# EAGLE board K019 (EAGLE 6.3), part 1 of 4
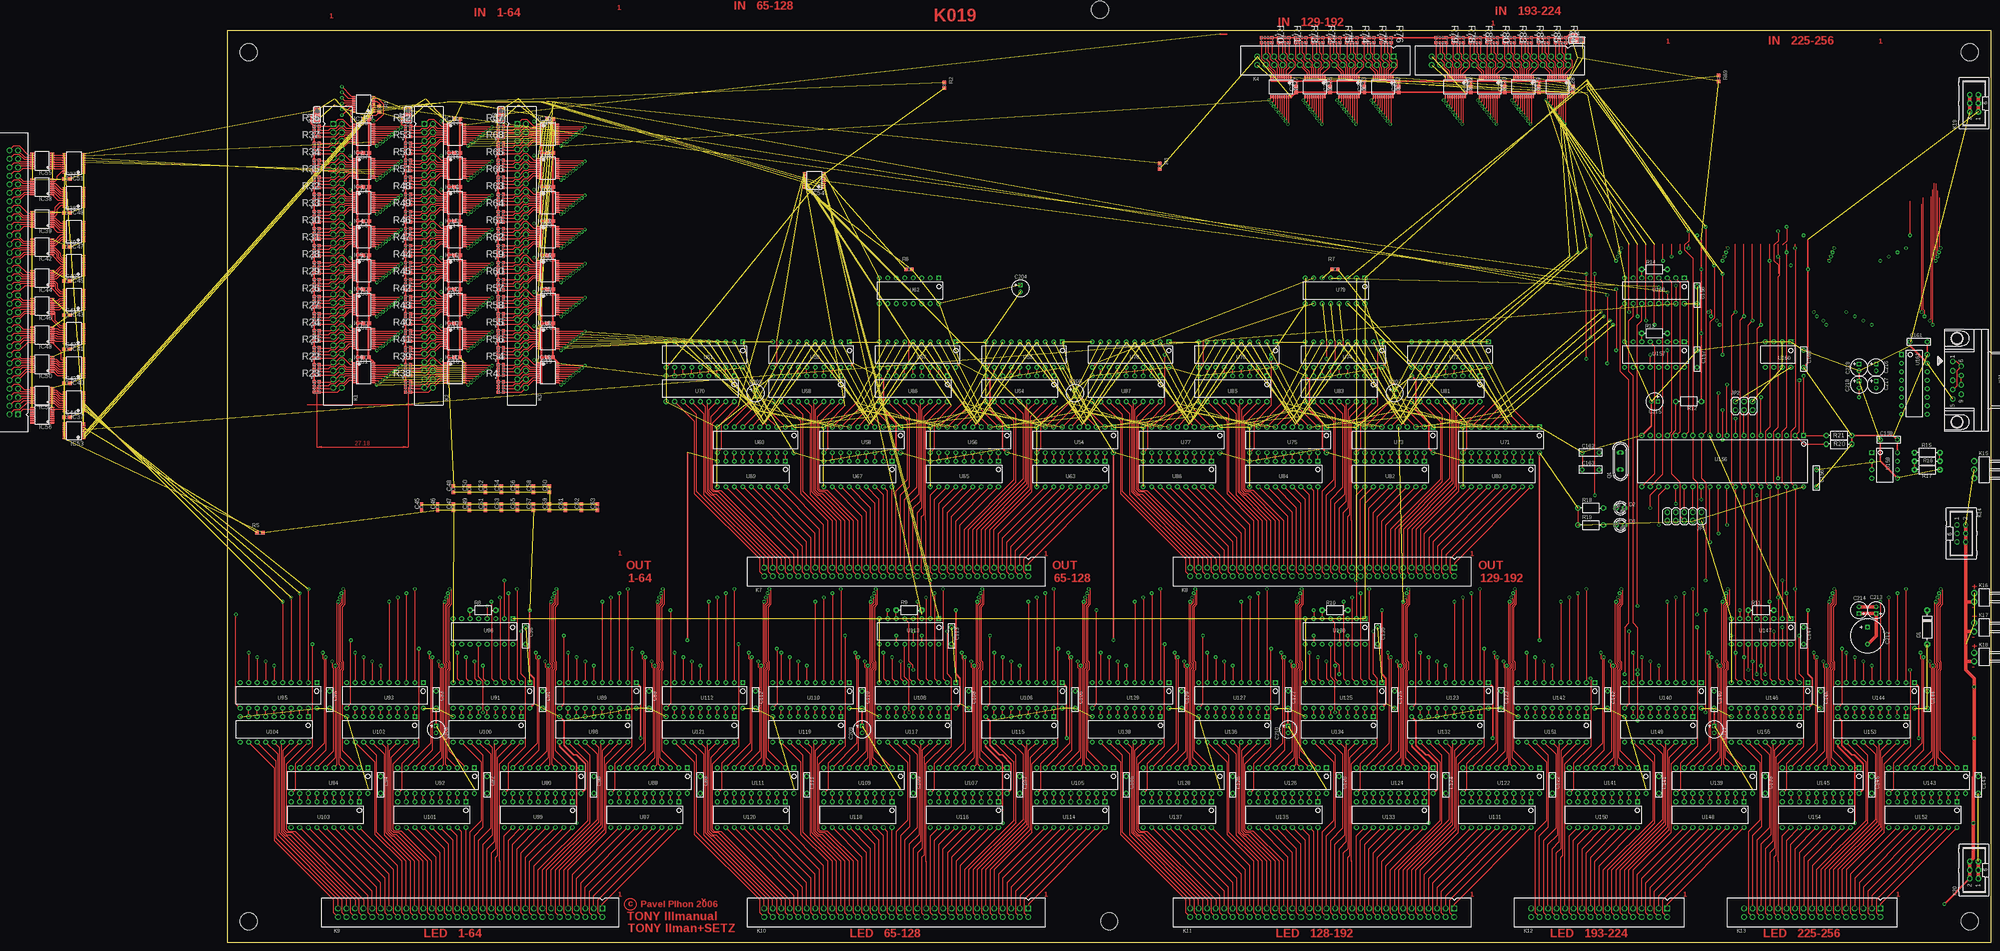
[diagram p5: board, top side]
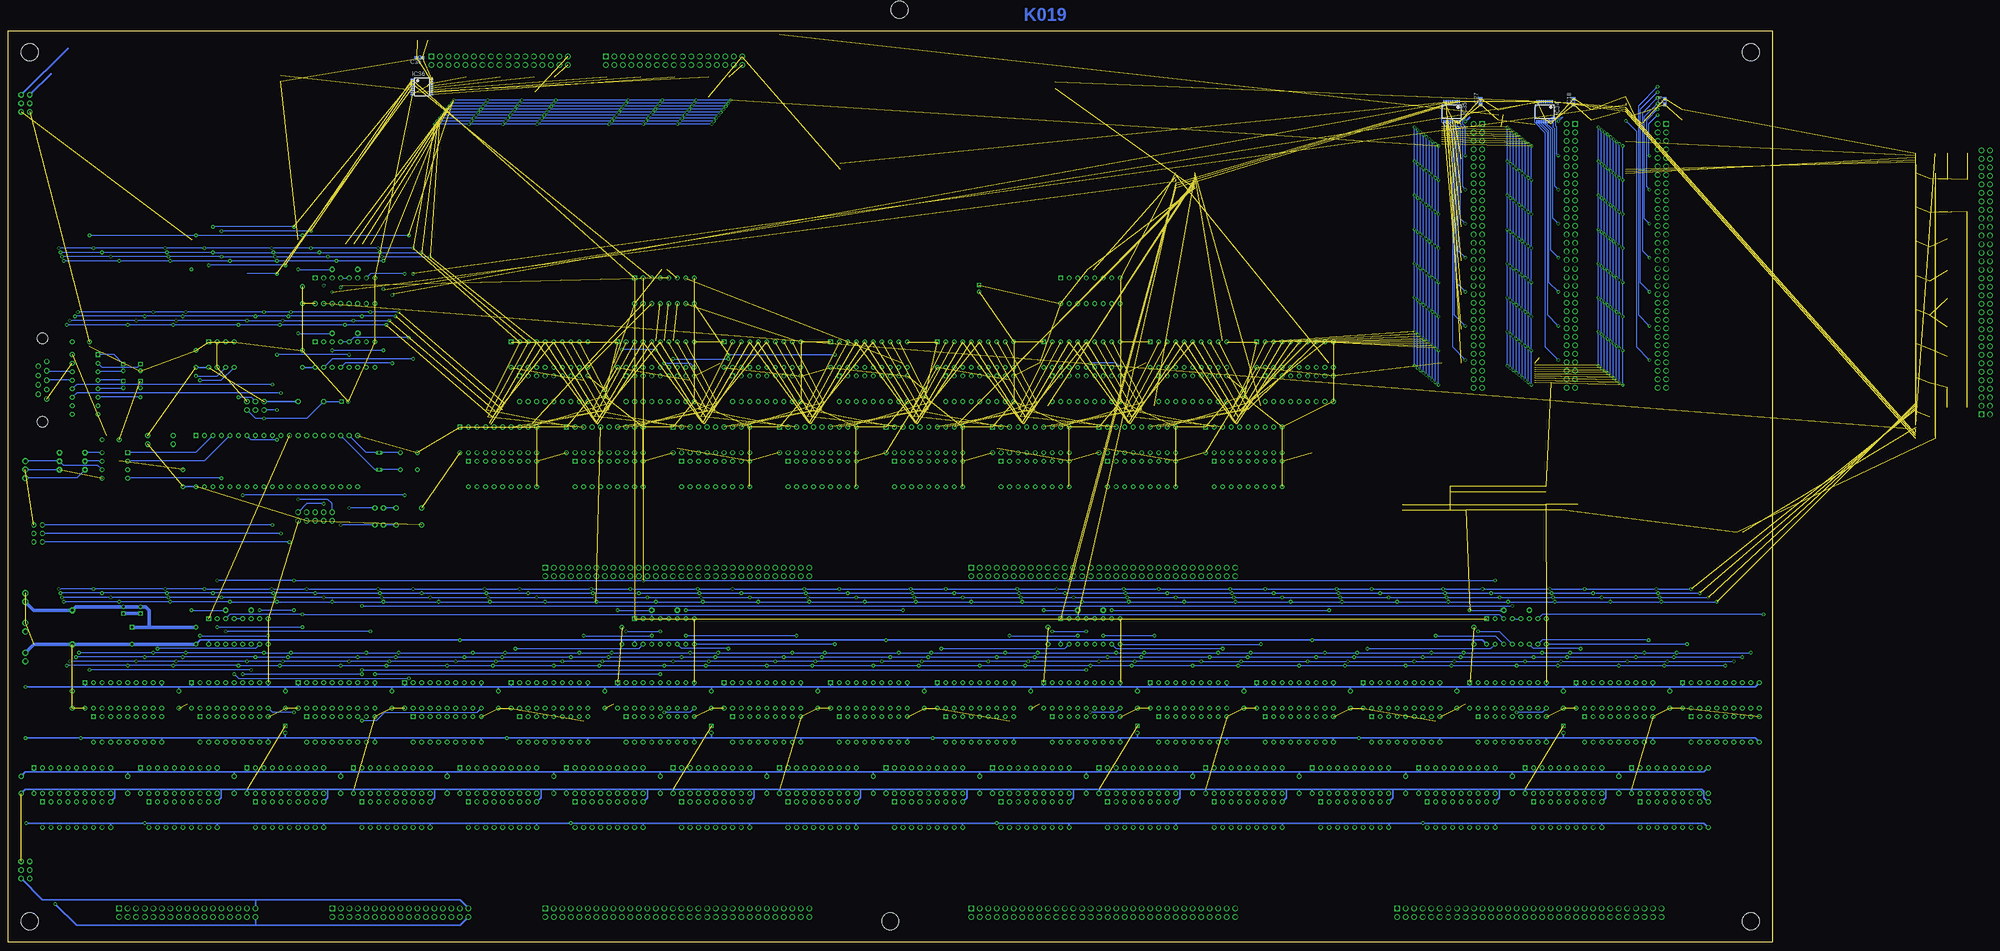
[diagram p6: board, bottom side, seen from below]

Size 525.78 x 271.78 mm. Coordinates in mm from the lower left corner, seen from the top.
Outline: 0,0 525.78,0 525.78,271.78 0,271.78 0,0
Copper layers (1*16): Top 0.035mm / dielectric 1.5mm / Bottom 0.035mm
Design rules "default *": minimum track width 10mil, minimum drill 24mil, track to track 0.2mm, track to pad 0.2mm, pad to pad 0.2mm, via to via 0.2mm, smd to smd 0mil, copper to edge 40mil, drill to drill 8mil, minimum pad ring 10mil, minimum via ring 8mil, stop-mask expansion 4mil, vias tented up to drill 0mil, thermal gap 10mil
Holes 5.08 mm at 6.35,265.43 6.35,6.35 519.43,6.35 519.43,265.43 260.1,278.13 262.89,6.35

## Footprints (pad centres in the part's own frame; a part is rotated, then mirrored left to right if it is on the bottom)
C0603 = smd 1.1 x 1: 1 -0.85,0; 2 0.85,0
C-5-2X8 = drill 0.813 pad 1.397: 1 0,0; 2 5.08,0
EC-2/5 = drill 0.711 pad 1.092: 1 1.016,0 | drill 0.711 pad 1.092 square: 2 -1.016,0
EC-5 = drill 0.813 pad 1.397 square: 1 -2.54,0 | drill 0.813 pad 1.397: 2 2.54,0
D-10 = drill 0.813 pad 1.778 octagon: 1 -5.08,0; 2 5.08,0
LED3 = drill 0.813 pad 1.6 octagon: A -1.27,0 | drill 0.813 pad 1.6: K 1.27,0
TSSOP20 = smd 0.35 x 0.9: 1 0,0; 2 0.65,0; 3 1.3,0; 4 1.95,0; 5 2.6,0; 6 3.25,0; 7 3.9,0; 8 4.55,0; 9 5.2,0; 10 5.85,0; 11 5.85,5.85; 12 5.2,5.85; 13 4.55,5.85; 14 3.9,5.85; 15 3.25,5.85; 16 2.6,5.85; 17 1.95,5.85; 18 1.3,5.85; 19 0.65,5.85; 20 0,5.85
TSSOP16 = smd 0.35 x 0.9: 1 0,0; 2 0.65,0; 3 1.3,0; 4 1.95,0; 5 2.6,0; 6 3.25,0; 7 3.9,0; 8 4.55,0; 9 4.55,5.85; 10 3.9,5.85; 11 3.25,5.85; 12 2.6,5.85; 13 1.95,5.85; 14 1.3,5.85; 15 0.65,5.85; 16 0,5.85
SSOP16 = smd 0.35 x 1.2: 1 0,0; 2 0.65,0; 3 1.3,0; 4 1.95,0; 5 2.6,0; 6 3.25,0; 7 3.9,0; 8 4.55,0; 9 4.55,5.85; 10 3.9,5.85; 11 3.25,5.85; 12 2.6,5.85; 13 1.95,5.85; 14 1.3,5.85; 15 0.65,5.85; 16 0,5.85
2X05 = drill 1.016 octagon: 1 -5.08,-1.27; 2 -5.08,1.27; 3 -2.54,-1.27; 4 -2.54,1.27; 5 0,-1.27; 6 0,1.27; 7 2.54,-1.27; 8 2.54,1.27; 9 5.08,-1.27; 10 5.08,1.27
2X03 = drill 1.016 octagon: 1 -2.54,-1.27; 2 -2.54,1.27; 3 0,-1.27; 4 0,1.27; 5 2.54,-1.27; 6 2.54,1.27
KON64 = drill 1.092 pad 1.6 square: 1 0,0 | drill 1.092 pad 1.6: 2 0,2.54; 3 2.54,0; 4 2.54,2.54; 5 5.08,0; 6 5.08,2.54; 7 7.62,0; 8 7.62,2.54; 9 10.16,0; 10 10.16,2.54; 11 12.7,0; 12 12.7,2.54; 13 15.24,0; 14 15.24,2.54; 15 17.78,0; 16 17.78,2.54; 17 20.32,0; 18 20.32,2.54; 19 22.86,0; 20 22.86,2.54; 21 25.4,0; 22 25.4,2.54; 23 27.94,0; 24 27.94,2.54; 25 30.48,0; 26 30.48,2.54; 27 33.02,0; 28 33.02,2.54; 29 35.56,0; 30 35.56,2.54; 31 38.1,0; 32 38.1,2.54; 33 40.64,0; 34 40.64,2.54; 35 43.18,0; 36 43.18,2.54; 37 45.72,0; 38 45.72,2.54; 39 48.26,0; 40 48.26,2.54; 41 50.8,0; 42 50.8,2.54; 43 53.34,0; 44 53.34,2.54; 45 55.88,0; 46 55.88,2.54; 47 58.42,0; 48 58.42,2.54; 49 60.96,0; 50 60.96,2.54; 51 63.5,0; 52 63.5,2.54; 53 66.04,0; 54 66.04,2.54; 55 68.58,0; 56 68.58,2.54; 57 71.12,0; 58 71.12,2.54; 59 73.66,0; 60 73.66,2.54; 61 76.2,0; 62 76.2,2.54; 63 78.74,0; 64 78.74,2.54
KON34 = drill 1.092 pad 1.6 square: 1 0,0 | drill 1.092 pad 1.6: 2 0,2.54; 3 2.54,0; 4 2.54,2.54; 5 5.08,0; 6 5.08,2.54; 7 7.62,0; 8 7.62,2.54; 9 10.16,0; 10 10.16,2.54; 11 12.7,0; 12 12.7,2.54; 13 15.24,0; 14 15.24,2.54; 15 17.78,0; 16 17.78,2.54; 17 20.32,0; 18 20.32,2.54; 19 22.86,0; 20 22.86,2.54; 21 25.4,0; 22 25.4,2.54; 23 27.94,0; 24 27.94,2.54; 25 30.48,0; 26 30.48,2.54; 27 33.02,0; 28 33.02,2.54; 29 35.56,0; 30 35.56,2.54; 31 38.1,0; 32 38.1,2.54; 33 40.64,0; 34 40.64,2.54
ML6 = drill 0.914 octagon: 1 -2.54,-1.27; 2 -2.54,1.27; 3 0,-1.27; 4 0,1.27; 5 2.54,-1.27; 6 2.54,1.27
PSH02-03 = drill 1.092 pad 1.803: 1 0,0; 2 2.54,0; 3 5.08,0
PSH02-02 = drill 1.092 pad 1.803: 1 0,0; 2 2.54,0
ML06 = drill 0.914 pad 1.6: 1 -2.54,-1.27 | drill 0.914 pad 1.6 octagon: 2 -2.54,1.27; 3 0,-1.27; 4 0,1.27; 5 2.54,-1.27; 6 2.54,1.27
D-09F/90 = drill 1.016 pad 1.575 octagon: 1 -5.588,-1.27; 2 -2.794,-1.27; 3 0,-1.27; 4 2.794,-1.27; 5 5.588,-1.27; 6 -4.191,1.27; 7 -1.397,1.27; 8 1.397,1.27; 9 4.191,1.27 | hole 3.2: 12.446,0; -12.446,0
QS = drill 0.61 long: 1 -2.54,0; 2 2.54,0
R0603 = smd 1 x 1.1: 1 -0.85,0; 2 0.85,0
RESCAXE80P320X160X60-8N = smd 0.864 x 0.965: 1 -0.762,1.524; 4 -0.762,-1.524; 5 0.762,-1.524; 8 0.762,1.524 | smd 0.864 x 0.457: 2 -0.762,0.432; 3 -0.762,-0.432; 6 0.762,-0.432; 7 0.762,0.432
R-7,5 = drill 0.813 pad 1.6 octagon: 1 -3.81,0; 2 3.81,0
SJ_2 = smd 1.168 x 1.6: 1 -1.524,0; 2 0,0; 3 1.524,0
DIL20 = drill 0.813 pad 1.397 square: 1 0,0 | drill 0.813 pad 1.397: 2 2.54,0; 3 5.08,0; 4 7.62,0; 5 10.16,0; 6 12.7,0; 7 15.24,0; 8 17.78,0; 9 20.32,0; 10 22.86,0; 11 22.86,7.62; 12 20.32,7.62; 13 17.78,7.62; 14 15.24,7.62; 15 12.7,7.62; 16 10.16,7.62; 17 7.62,7.62; 18 5.08,7.62; 19 2.54,7.62; 20 0,7.62
DIL16 = drill 0.813 pad 1.397 square: 1 0,0 | drill 0.813 pad 1.397: 2 2.54,0; 3 5.08,0; 4 7.62,0; 5 10.16,0; 6 12.7,0; 7 15.24,0; 8 17.78,0; 9 17.78,7.62; 10 15.24,7.62; 11 12.7,7.62; 12 10.16,7.62; 13 7.62,7.62; 14 5.08,7.62; 15 2.54,7.62; 16 0,7.62
DIL18 = drill 0.813 pad 1.397 square: 1 0,0 | drill 0.813 pad 1.397: 2 2.54,0; 3 5.08,0; 4 7.62,0; 5 10.16,0; 6 12.7,0; 7 15.24,0; 8 17.78,0; 9 20.32,0; 10 20.32,7.62; 11 17.78,7.62; 12 15.24,7.62; 13 12.7,7.62; 14 10.16,7.62; 15 7.62,7.62; 16 5.08,7.62; 17 2.54,7.62; 18 0,7.62
DIL40 = drill 0.813 pad 1.397 square: 1 -24.13,-7.62 | drill 0.813 pad 1.397: 2 -21.59,-7.62; 3 -19.05,-7.62; 4 -16.51,-7.62; 5 -13.97,-7.62; 6 -11.43,-7.62; 7 -8.89,-7.62; 8 -6.35,-7.62; 9 -3.81,-7.62; 10 -1.27,-7.62; 11 1.27,-7.62; 12 3.81,-7.62; 13 6.35,-7.62; 14 8.89,-7.62; 15 11.43,-7.62; 16 13.97,-7.62; 17 16.51,-7.62; 18 19.05,-7.62; 19 21.59,-7.62; 20 24.13,-7.62; 21 24.13,7.62; 22 21.59,7.62; 23 19.05,7.62; 24 16.51,7.62; 25 13.97,7.62; 26 11.43,7.62; 27 8.89,7.62; 28 6.35,7.62; 29 3.81,7.62; 30 1.27,7.62; 31 -1.27,7.62; 32 -3.81,7.62; 33 -6.35,7.62; 34 -8.89,7.62; 35 -11.43,7.62; 36 -13.97,7.62; 37 -16.51,7.62; 38 -19.05,7.62; 39 -21.59,7.62; 40 -24.13,7.62
DIL-08 = drill 0.813 pad 1.397 square: 1 0,0 | drill 0.813 pad 1.397: 2 2.54,0; 3 5.08,0; 4 7.62,0; 5 7.62,7.62; 6 5.08,7.62; 7 2.54,7.62; 8 0,7.62

## Placement (x,y rotation side)
C1  100n  [C0603]  41.34,174.43 180 top
C2  100n  [C0603]  41.4,184.59 180 top
C3  100n  [C0603]  41.4,194.75 180 top
C4  100n  [C0603]  41.4,204.91 180 top
C5  100n  [C0603]  41.4,215.07 180 top
C6  100n  [C0603]  41.4,225.23 180 top
C7  100n  [C0603]  41.4,235.39 180 top
C8  100n  [C0603]  41.4,245.55 180 top
C9  100n  [C0603]  32,250.7 90 bottom
C10  100n  [C0603]  68.52,174.43 180 top
C11  100n  [C0603]  68.58,184.59 180 top
C12  100n  [C0603]  68.58,194.75 180 top
C13  100n  [C0603]  68.58,204.91 180 top
C14  100n  [C0603]  68.58,215.07 180 top
C15  100n  [C0603]  68.58,225.23 180 top
C16  100n  [C0603]  68.58,235.39 180 top
C17  100n  [C0603]  68.58,245.55 180 top
C18  100n  [C0603]  59.18,250.7 90 bottom
C19  100n  [C0603]  96.2,174.43 180 top
C20  100n  [C0603]  96.27,184.59 180 top
C21  100n  [C0603]  96.27,194.75 180 top
C22  100n  [C0603]  96.27,204.91 180 top
C23  100n  [C0603]  96.27,215.07 180 top
C24  100n  [C0603]  96.27,225.23 180 top
C25  100n  [C0603]  96.27,235.39 180 top
C26  100n  [C0603]  96.27,245.55 180 top
C27  100n  [C0603]  86.87,250.7 90 bottom
C28  100n  [C0603]  318.64,254.38 90 top
C29  100n  [C0603]  328.8,254.32 90 top
C30  100n  [C0603]  338.96,254.32 90 top
C31  100n  [C0603]  349.12,254.32 90 top
C32  100n  [C0603]  370.65,254.32 90 top
C33  100n  [C0603]  380.81,254.32 90 top
C34  100n  [C0603]  390.97,254.32 90 top
C35  100n  [C0603]  401.13,254.32 90 top
C36  100n  [C0603]  403.23,263.78 180 bottom
C37  100n  [C0603]  -47.82,227.71 0 top  (outside the outline)
C38  100n  [C0603]  -47.82,217.55 0 top  (outside the outline)
C39  100n  [C0603]  -47.82,207.39 0 top  (outside the outline)
C40  100n  [C0603]  -47.82,197.23 0 top  (outside the outline)
C41  100n  [C0603]  -47.82,187.07 0 top  (outside the outline)
C42  100n  [C0603]  -47.82,176.91 0 top  (outside the outline)
C43  100n  [C0603]  -47.82,166.75 0 top  (outside the outline)
C44  100n  [C0603]  -47.82,156.59 0 top  (outside the outline)
C45  100n  [C0603]  57.91,129.79 90 top
C46  100n  [C0603]  62.67,129.79 90 top
C47  100n  [C0603]  67.44,129.79 90 top
C48  100n  [C0603]  67.44,135.13 90 top
C49  100n  [C0603]  72.2,129.79 90 top
C50  100n  [C0603]  72.2,135.13 90 top
C51  100n  [C0603]  76.96,129.79 90 top
C52  100n  [C0603]  76.96,135.13 90 top
C53  100n  [C0603]  81.72,129.79 90 top
C54  100n  [C0603]  81.72,135.13 90 top
C55  100n  [C0603]  86.49,129.79 90 top
C56  100n  [C0603]  86.49,135.13 90 top
C57  100n  [C0603]  91.25,129.79 90 top
C58  100n  [C0603]  91.25,135.13 90 top
C59  100n  [C0603]  96.01,129.79 90 top
C60  100n  [C0603]  96.01,135.13 90 top
C61  100n  [C0603]  100.77,129.79 90 top
C62  100n  [C0603]  105.54,129.79 90 top
C63  100n  [C0603]  110.3,129.79 90 top
C88  100n  [C-5-2X8]  140.97,49.53 270 top
C89  100n  [C-5-2X8]  125.73,74.93 270 top
C90  100n  [C-5-2X8]  109.22,49.53 270 top
C91  100n  [C-5-2X8]  93.98,74.93 270 top
C92  100n  [C-5-2X8]  77.47,49.53 270 top
C93  100n  [C-5-2X8]  62.23,74.93 270 top
C94  100n  [C-5-2X8]  45.72,49.53 270 top
C95  100n  [C-5-2X8]  30.48,74.93 270 top
C96  100n  [C-5-2X8]  88.9,93.98 270 top
C105  100n  [C-5-2X8]  267.97,49.53 270 top
C106  100n  [C-5-2X8]  252.73,74.93 270 top
C107  100n  [C-5-2X8]  236.22,49.53 270 top
C108  100n  [C-5-2X8]  220.98,74.93 270 top
C109  100n  [C-5-2X8]  204.47,49.53 270 top
C110  100n  [C-5-2X8]  189.23,74.93 270 top
C111  100n  [C-5-2X8]  172.72,49.53 270 top
C112  100n  [C-5-2X8]  157.48,74.93 270 top
C113  100n  [C-5-2X8]  215.9,93.98 270 top
C122  100n  [C-5-2X8]  394.97,49.53 270 top
C123  100n  [C-5-2X8]  379.73,74.93 270 top
C124  100n  [C-5-2X8]  363.22,49.53 270 top
C125  100n  [C-5-2X8]  347.98,74.93 270 top
C126  100n  [C-5-2X8]  331.47,49.53 270 top
C127  100n  [C-5-2X8]  316.23,74.93 270 top
C128  100n  [C-5-2X8]  299.72,49.53 270 top
C129  100n  [C-5-2X8]  284.48,74.93 270 top
C130  100n  [C-5-2X8]  342.9,93.98 270 top
C139  100n  [C-5-2X8]  458.47,49.53 270 top
C140  100n  [C-5-2X8]  443.23,74.93 270 top
C141  100n  [C-5-2X8]  426.72,49.53 270 top
C142  100n  [C-5-2X8]  411.48,74.93 270 top
C143  100n  [C-5-2X8]  521.97,49.53 270 top
C144  100n  [C-5-2X8]  506.73,74.93 270 top
C145  100n  [C-5-2X8]  490.22,49.53 270 top
C146  100n  [C-5-2X8]  474.98,74.93 270 top
C147  100n  [C-5-2X8]  469.9,93.98 270 top
C156  100n  [C-5-2X8]  473.71,140.97 270 top
C157  100n  [C-5-2X8]  438.15,176.53 270 top
C158  100n  [C-5-2X8]  438.15,195.58 270 top
C159  100n  [C-5-2X8]  492.76,149.86 0 top
C160  100n  [C-5-2X8]  469.9,176.53 270 top
C161  100n  [C-5-2X8]  501.65,179.07 0 top
C162  22  [C-5-2X8]  403.86,146.05 0 top
C163  22  [C-5-2X8]  403.86,140.97 0 top
C204  22M  [EC-2/5]  236.41,195.01 270 top
C205  22M  [EC-2/5]  157.48,163.83 270 top
C206  22M  [EC-2/5]  252.73,163.83 270 top
C207  22M  [EC-2/5]  347.98,163.83 270 top
C208  22M  [EC-2/5]  62.23,63.5 270 top
C209  22M  [EC-2/5]  189.23,63.5 270 top
C210  22M  [EC-2/5]  316.23,63.5 270 top
C211  22M  [EC-2/5]  443.23,63.5 270 top
C212  220M  [EC-5]  488.95,91.44 270 top
C213  22M  [EC-2/5]  491.49,99.06 90 top
C214  22M  [EC-2/5]  486.41,99.06 90 top
C215  2M2  [EC-2/5]  425.45,161.29 180 top
C216  2M2  [EC-2/5]  491.49,171.45 270 top
C217  2M2  [EC-2/5]  491.49,166.37 270 top
C218  2M2  [EC-2/5]  486.41,166.37 270 top
C219  2M2  [EC-2/5]  486.41,171.45 270 top
D1  5V6  [D-10]  506.73,93.98 90 top
D2  LEDG  [LED3]  415.29,129.54 0 top
D3  LEDR  [LED3]  415.29,124.46 0 top
IC1  74573  [TSSOP20]  37.72,243.9 270 top
IC2  74573  [TSSOP20]  37.72,233.74 270 top
IC3  74573  [TSSOP20]  37.72,223.58 270 top
IC4  74573  [TSSOP20]  37.72,213.42 270 top
IC5  74573  [TSSOP20]  37.72,203.26 270 top
IC6  74573  [TSSOP20]  37.72,193.1 270 top
IC7  74573  [TSSOP20]  37.72,182.94 270 top
IC8  74573  [TSSOP20]  37.72,172.78 270 top
IC9  74138PW  [TSSOP16]  43.56,247.65 90 top
IC10  74573  [TSSOP20]  64.9,182.94 270 top
IC11  74573  [TSSOP20]  64.9,172.78 270 top
IC12  74573  [TSSOP20]  64.9,243.9 270 top
IC13  74573  [TSSOP20]  64.9,233.74 270 top
IC14  74573  [TSSOP20]  64.9,223.58 270 top
IC15  74573  [TSSOP20]  64.9,213.42 270 top
IC16  74573  [TSSOP20]  64.9,203.26 270 top
IC17  74573  [TSSOP20]  64.9,193.1 270 top
IC18  74573  [TSSOP20]  92.58,182.94 270 top
IC19  74573  [TSSOP20]  92.58,172.78 270 top
IC20  74573  [TSSOP20]  92.58,243.9 270 top
IC21  74573  [TSSOP20]  92.58,233.74 270 top
IC22  74573  [TSSOP20]  92.58,223.58 270 top
IC23  74573  [TSSOP20]  92.58,213.42 270 top
IC24  74573  [TSSOP20]  92.58,203.26 270 top
IC25  74573  [TSSOP20]  92.58,193.1 270 top
IC26  74573  [TSSOP20]  327.15,258 180 top
IC27  74573  [TSSOP20]  316.99,258 180 top
IC28  74573  [TSSOP20]  399.48,258 180 top
IC29  74573  [TSSOP20]  389.32,258 180 top
IC30  74573  [TSSOP20]  379.16,258 180 top
IC31  74573  [TSSOP20]  369,258 180 top
IC32  74573  [TSSOP20]  347.47,258 180 top
IC33  74573  [TSSOP20]  337.31,258 180 top
IC34  74138PW  [TSSOP16]  65.6,250.63 180 bottom
IC35  74138PW  [TSSOP16]  93.28,250.63 180 bottom
IC36  74138PW  [TSSOP16]  405.45,257.3 270 bottom
IC37  74574PW  [TSSOP20]  -42.8,158.25 90 top  (outside the outline)
IC38  ULN2003APW  [SSOP16]  -52.26,222.95 90 top  (outside the outline)
IC39  ULN2003APW  [SSOP16]  -52.26,213.36 90 top  (outside the outline)
IC40  74574PW  [TSSOP20]  -42.8,168.41 90 top  (outside the outline)
IC41  74574PW  [TSSOP20]  -42.8,178.57 90 top  (outside the outline)
IC42  ULN2003APW  [SSOP16]  -52.26,205.1 90 top  (outside the outline)
IC43  74574PW  [TSSOP20]  -42.8,188.73 90 top  (outside the outline)
IC44  ULN2003APW  [SSOP16]  -52.26,195.77 90 top  (outside the outline)
IC45  74574PW  [TSSOP20]  -42.8,198.89 90 top  (outside the outline)
IC46  ULN2003APW  [SSOP16]  -52.26,187.45 90 top  (outside the outline)
IC47  74574PW  [TSSOP20]  -42.8,209.05 90 top  (outside the outline)
IC48  ULN2003APW  [SSOP16]  -52.26,178.88 90 top  (outside the outline)
IC49  74574PW  [TSSOP20]  -42.8,219.21 90 top  (outside the outline)
IC50  ULN2003APW  [SSOP16]  -52.26,170.12 90 top  (outside the outline)
IC51  74574PW  [TSSOP20]  -42.8,229.37 90 top  (outside the outline)
IC52  ULN2003APW  [SSOP16]  -52.26,160.85 90 top  (outside the outline)
IC53  74138PW  [TSSOP16]  -42.8,150.3 90 top  (outside the outline)
IC54  74138PW  [TSSOP16]  177.93,224.98 90 top
IC55  ULN2003APW  [SSOP16]  -52.26,230.76 90 top  (outside the outline)
IC56  ULN2003APW  [SSOP16]  -52.26,154.94 90 top  (outside the outline)
JP1  JTAG  [2X05]  434.34,127 180 top
JP2  ISP  [2X03]  452.12,160.02 0 top
K1  KON64  [KON64]  31.56,244.09 270 top
K2  KON64  [KON64]  58.74,244.09 270 top
K3  KON64  [KON64]  86.42,244.09 270 top
K4  KON34  [KON34]  347.66,264.16 180 top
K5  KON34  [KON34]  399.67,264.16 180 top
K6  KON64  [KON64]  -62.42,157.42 90 top  (outside the outline)
K7  KON64  [KON64]  238.76,111.76 180 top
K8  KON64  [KON64]  365.76,111.76 180 top
K9  KON64  [KON64]  111.76,10.16 180 top
K10  KON64  [KON64]  238.76,10.16 180 top
K11  KON64  [KON64]  365.76,10.16 180 top
K12  KON34  [KON34]  429.26,10.16 180 top
K13  KON34  [KON34]  492.76,10.16 180 top
K14  KLIC  [ML6]  516.89,121.92 270 top
K15  PSH02-03W  [PSH02-03]  520.7,143.51 270 top
K16  PSH02-02W  [PSH02-02]  520.7,104.14 270 top
K17  PSH02-02W  [PSH02-02]  520.7,95.25 270 top
K18  PSH02-02W  [PSH02-02]  520.7,86.36 270 top
K19  PWR  [ML06]  520.7,250.19 90 top
K20  PWR  [ML06]  520.7,21.59 90 top
K21  RS232  [D-09F/90]  515.62,167.64 270 top
Q1  14.745MHz  [QS]  415.29,143.51 90 top
R1  1k  [R0603]  45.34,248.48 270 top
R2  1k  [R0603]  213.74,255.59 270 top
R3  1k  [R0603]  277.94,231.46 270 top
R4  47K  [RESCAXE80P320X160X60-8N]  81.53,165.61 0 top
R5  1k  [R0603]  9.72,122.17 180 top
R6  1k  [R0603]  203.2,200.66 180 top
R7  1k  [R0603]  330.2,200.66 180 top
R8  1k  [R-7,5]  76.2,99.06 180 top
R9  1k  [R-7,5]  203.2,99.06 180 top
R10  1k  [R-7,5]  330.2,99.06 180 top
R11  1k  [R-7,5]  457.2,99.06 180 top
R12  10k  [R-7,5]  435.61,161.29 180 top
R13  1k  [R-7,5]  425.45,181.61 180 top
R14  1k  [R-7,5]  425.45,200.66 180 top
R15  2k2  [R-7,5]  506.73,146.05 180 top
R16  120  [R-7,5]  506.73,143.51 0 top
R17  2k2  [R-7,5]  506.73,140.97 180 top
R18  1k  [R-7,5]  406.4,129.54 0 top
R19  1k  [R-7,5]  406.4,124.46 0 top
R20  4k7  [R-7,5]  480.44,148.59 180 top
R21  4k7  [R-7,5]  480.44,151.13 180 top
R22  47K  [RESCAXE80P320X160X60-8N]  26.67,170.69 0 top
R23  47K  [RESCAXE80P320X160X60-8N]  26.67,165.61 0 top
R24  47K  [RESCAXE80P320X160X60-8N]  26.67,180.85 0 top
R25  47K  [RESCAXE80P320X160X60-8N]  26.67,175.77 0 top
R26  47K  [RESCAXE80P320X160X60-8N]  26.67,191.01 0 top
R27  47K  [RESCAXE80P320X160X60-8N]  26.67,185.93 0 top
R28  47K  [RESCAXE80P320X160X60-8N]  26.67,201.17 0 top
R29  47K  [RESCAXE80P320X160X60-8N]  26.67,196.09 0 top
R30  47K  [RESCAXE80P320X160X60-8N]  26.67,211.33 0 top
R31  47K  [RESCAXE80P320X160X60-8N]  26.67,206.25 0 top
R32  47K  [RESCAXE80P320X160X60-8N]  26.67,221.49 0 top
R33  47K  [RESCAXE80P320X160X60-8N]  26.67,216.41 0 top
R34  47K  [RESCAXE80P320X160X60-8N]  26.67,231.65 0 top
R35  47K  [RESCAXE80P320X160X60-8N]  26.67,226.57 0 top
R36  47K  [RESCAXE80P320X160X60-8N]  26.67,241.81 0 top
R37  47K  [RESCAXE80P320X160X60-8N]  26.67,236.73 0 top
R38  47K  [RESCAXE80P320X160X60-8N]  53.85,165.61 0 top
R39  47K  [RESCAXE80P320X160X60-8N]  53.85,170.69 0 top
R40  47K  [RESCAXE80P320X160X60-8N]  53.85,180.85 0 top
R41  47K  [RESCAXE80P320X160X60-8N]  53.85,175.77 0 top
R42  47K  [RESCAXE80P320X160X60-8N]  53.85,191.01 0 top
R43  47K  [RESCAXE80P320X160X60-8N]  53.85,185.93 0 top
R44  47K  [RESCAXE80P320X160X60-8N]  53.85,201.17 0 top
R45  47K  [RESCAXE80P320X160X60-8N]  53.85,196.09 0 top
R46  47K  [RESCAXE80P320X160X60-8N]  53.85,211.33 0 top
R47  47K  [RESCAXE80P320X160X60-8N]  53.85,206.25 0 top
R48  47K  [RESCAXE80P320X160X60-8N]  53.85,221.49 0 top
R49  47K  [RESCAXE80P320X160X60-8N]  53.85,216.41 0 top
R50  47K  [RESCAXE80P320X160X60-8N]  53.85,231.65 0 top
R51  47K  [RESCAXE80P320X160X60-8N]  53.85,226.57 0 top
R52  47K  [RESCAXE80P320X160X60-8N]  53.85,241.81 0 top
R53  47K  [RESCAXE80P320X160X60-8N]  53.85,236.73 0 top
R54  47K  [RESCAXE80P320X160X60-8N]  81.53,170.69 0 top
R55  47K  [RESCAXE80P320X160X60-8N]  81.53,180.85 0 top
R56  47K  [RESCAXE80P320X160X60-8N]  81.53,175.77 0 top
R57  47K  [RESCAXE80P320X160X60-8N]  81.53,191.01 0 top
R58  47K  [RESCAXE80P320X160X60-8N]  81.53,185.93 0 top
R59  47K  [RESCAXE80P320X160X60-8N]  81.53,201.17 0 top
R60  47K  [RESCAXE80P320X160X60-8N]  81.53,196.09 0 top
R61  47K  [RESCAXE80P320X160X60-8N]  81.53,211.33 0 top
R62  47K  [RESCAXE80P320X160X60-8N]  81.53,206.25 0 top
R63  47K  [RESCAXE80P320X160X60-8N]  81.53,221.49 0 top
R64  47K  [RESCAXE80P320X160X60-8N]  81.53,216.41 0 top
R65  47K  [RESCAXE80P320X160X60-8N]  81.53,231.65 0 top
R66  47K  [RESCAXE80P320X160X60-8N]  81.53,226.57 0 top
R67  47K  [RESCAXE80P320X160X60-8N]  81.53,241.81 0 top
R68  47K  [RESCAXE80P320X160X60-8N]  81.53,236.73 0 top
R69  1k  [R0603]  444.56,257.62 270 top
R70  47K  [RESCAXE80P320X160X60-8N]  309.82,269.05 270 top
R71  47K  [RESCAXE80P320X160X60-8N]  314.9,269.05 270 top
R72  47K  [RESCAXE80P320X160X60-8N]  325.06,269.05 270 top
R73  47K  [RESCAXE80P320X160X60-8N]  319.98,269.05 270 top
R74  47K  [RESCAXE80P320X160X60-8N]  335.22,269.05 270 top
R75  47K  [RESCAXE80P320X160X60-8N]  330.14,269.05 270 top
R76  47K  [RESCAXE80P320X160X60-8N]  345.38,269.05 270 top
R77  47K  [RESCAXE80P320X160X60-8N]  340.3,269.05 270 top
R78  47K  [RESCAXE80P320X160X60-8N]  366.9,269.05 270 top
R79  47K  [RESCAXE80P320X160X60-8N]  361.82,269.05 270 top
R80  47K  [RESCAXE80P320X160X60-8N]  377.06,269.05 270 top
R81  47K  [RESCAXE80P320X160X60-8N]  371.98,269.05 270 top
R82  47K  [RESCAXE80P320X160X60-8N]  387.22,269.05 270 top
R83  47K  [RESCAXE80P320X160X60-8N]  382.14,269.05 270 top
R84  47K  [RESCAXE80P320X160X60-8N]  397.38,269.05 270 top
R85  47K  [RESCAXE80P320X160X60-8N]  392.3,269.05 270 top
SJ1  [SJ_2]  26.73,246.76 90 top
SJ2  [SJ_2]  53.91,246.76 90 top
SJ3  [SJ_2]  81.6,246.76 90 top
SJ4  [SJ_2]  402.34,268.99 0 top
U54  74HC574  [DIL20]  264.16,153.67 180 top
U55  74HC574  [DIL20]  248.92,179.07 180 top
U56  74HC574  [DIL20]  232.41,153.67 180 top
U57  74HC574  [DIL20]  217.17,179.07 180 top
U58  74HC574  [DIL20]  200.66,153.67 180 top
U59  74HC574  [DIL20]  185.42,179.07 180 top
U60  74HC574  [DIL20]  168.91,153.67 180 top
U61  74HC574  [DIL20]  153.67,179.07 180 top
U62  74HC138  [DIL16]  212.09,198.12 180 top
U63  TD62783F  [DIL18]  261.62,143.51 180 top
U64  TD62783F  [DIL18]  246.38,168.91 180 top
U65  TD62783F  [DIL18]  229.87,143.51 180 top
U66  TD62783F  [DIL18]  214.63,168.91 180 top
U67  TD62783F  [DIL18]  198.12,143.51 180 top
U68  TD62783F  [DIL18]  182.88,168.91 180 top
U69  TD62783F  [DIL18]  166.37,143.51 180 top
U70  TD62783F  [DIL18]  151.13,168.91 180 top
U71  74HC574  [DIL20]  391.16,153.67 180 top
U72  74HC574  [DIL20]  375.92,179.07 180 top
U73  74HC574  [DIL20]  359.41,153.67 180 top
U74  74HC574  [DIL20]  344.17,179.07 180 top
U75  74HC574  [DIL20]  327.66,153.67 180 top
U76  74HC574  [DIL20]  312.42,179.07 180 top
U77  74HC574  [DIL20]  295.91,153.67 180 top
U78  74HC574  [DIL20]  280.67,179.07 180 top
U79  74HC138  [DIL16]  339.09,198.12 180 top
U80  TD62783F  [DIL18]  388.62,143.51 180 top
U81  TD62783F  [DIL18]  373.38,168.91 180 top
U82  TD62783F  [DIL18]  356.87,143.51 180 top
U83  TD62783F  [DIL18]  341.63,168.91 180 top
U84  TD62783F  [DIL18]  325.12,143.51 180 top
U85  TD62783F  [DIL18]  309.88,168.91 180 top
U86  TD62783F  [DIL18]  293.37,143.51 180 top
U87  TD62783F  [DIL18]  278.13,168.91 180 top
U88  74HC574  [DIL20]  137.16,52.07 180 top
U89  74HC574  [DIL20]  121.92,77.47 180 top
U90  74HC574  [DIL20]  105.41,52.07 180 top
U91  74HC574  [DIL20]  90.17,77.47 180 top
U92  74HC574  [DIL20]  73.66,52.07 180 top
U93  74HC574  [DIL20]  58.42,77.47 180 top
U94  74HC574  [DIL20]  41.91,52.07 180 top
U95  74HC574  [DIL20]  26.67,77.47 180 top
U96  74HC138  [DIL16]  85.09,96.52 180 top
U97  TD62783F  [DIL18]  134.62,41.91 180 top
U98  TD62783F  [DIL18]  119.38,67.31 180 top
U99  TD62783F  [DIL18]  102.87,41.91 180 top
U100  TD62783F  [DIL18]  87.63,67.31 180 top
U101  TD62783F  [DIL18]  71.12,41.91 180 top
U102  TD62783F  [DIL18]  55.88,67.31 180 top
U103  TD62783F  [DIL18]  39.37,41.91 180 top
U104  TD62783F  [DIL18]  24.13,67.31 180 top
U105  74HC574  [DIL20]  264.16,52.07 180 top
U106  74HC574  [DIL20]  248.92,77.47 180 top
U107  74HC574  [DIL20]  232.41,52.07 180 top
U108  74HC574  [DIL20]  217.17,77.47 180 top
U109  74HC574  [DIL20]  200.66,52.07 180 top
U110  74HC574  [DIL20]  185.42,77.47 180 top
U111  74HC574  [DIL20]  168.91,52.07 180 top
U112  74HC574  [DIL20]  153.67,77.47 180 top
U113  74HC138  [DIL16]  212.09,96.52 180 top
U114  TD62783F  [DIL18]  261.62,41.91 180 top
U115  TD62783F  [DIL18]  246.38,67.31 180 top
U116  TD62783F  [DIL18]  229.87,41.91 180 top
U117  TD62783F  [DIL18]  214.63,67.31 180 top
U118  TD62783F  [DIL18]  198.12,41.91 180 top
U119  TD62783F  [DIL18]  182.88,67.31 180 top
U120  TD62783F  [DIL18]  166.37,41.91 180 top
U121  TD62783F  [DIL18]  151.13,67.31 180 top
U122  74HC574  [DIL20]  391.16,52.07 180 top
U123  74HC574  [DIL20]  375.92,77.47 180 top
U124  74HC574  [DIL20]  359.41,52.07 180 top
U125  74HC574  [DIL20]  344.17,77.47 180 top
U126  74HC574  [DIL20]  327.66,52.07 180 top
U127  74HC574  [DIL20]  312.42,77.47 180 top
U128  74HC574  [DIL20]  295.91,52.07 180 top
U129  74HC574  [DIL20]  280.67,77.47 180 top
U130  74HC138  [DIL16]  339.09,96.52 180 top
U131  TD62783F  [DIL18]  388.62,41.91 180 top
U132  TD62783F  [DIL18]  373.38,67.31 180 top
U133  TD62783F  [DIL18]  356.87,41.91 180 top
U134  TD62783F  [DIL18]  341.63,67.31 180 top
U135  TD62783F  [DIL18]  325.12,41.91 180 top
U136  TD62783F  [DIL18]  309.88,67.31 180 top
U137  TD62783F  [DIL18]  293.37,41.91 180 top
U138  TD62783F  [DIL18]  278.13,67.31 180 top
U139  74HC574  [DIL20]  454.66,52.07 180 top
U140  74HC574  [DIL20]  439.42,77.47 180 top
U141  74HC574  [DIL20]  422.91,52.07 180 top
U142  74HC574  [DIL20]  407.67,77.47 180 top
U143  74HC574  [DIL20]  518.16,52.07 180 top
U144  74HC574  [DIL20]  502.92,77.47 180 top
U145  74HC574  [DIL20]  486.41,52.07 180 top
U146  74HC574  [DIL20]  471.17,77.47 180 top
U147  74HC138  [DIL16]  466.09,96.52 180 top
U148  TD62783F  [DIL18]  452.12,41.91 180 top
U149  TD62783F  [DIL18]  436.88,67.31 180 top
U150  TD62783F  [DIL18]  420.37,41.91 180 top
U151  TD62783F  [DIL18]  405.13,67.31 180 top
U152  TD62783F  [DIL18]  515.62,41.91 180 top
U153  TD62783F  [DIL18]  500.38,67.31 180 top
U154  TD62783F  [DIL18]  483.87,41.91 180 top
U155  TD62783F  [DIL18]  468.63,67.31 180 top
U156  MEGA162  [DIL40]  445.77,143.51 180 top
U157  74HC138  [DIL16]  434.34,179.07 180 top
U158  74HC138  [DIL16]  434.34,198.12 180 top
U159  SP485  [DIL-08]  490.22,146.05 270 top
U160  24C64  [DIL-08]  466.09,179.07 180 top
U161  MAX232  [DIL16]  499.11,175.26 270 top

## Tracks (layer width: path | path; a pad name or v marks a point on that pad's centre or on a via)
A0  (via drill 0.51 pad 0.99)  (11 unrouted)
  Top 0.254: U156.12 441.96,184.91 443.23,186.18 v443.23,201.93
  Bottom 0.254: v443.23,201.93 v466.09,201.93
A1  (via drill 0.51 pad 0.99)  (7 unrouted)
  Top 0.254: 463.55,207.9 464.82,209.17 v464.82,213.36 | v82.55,107.95 U96.2 | v463.55,107.95 U147.2 | v336.55,107.95 U130.2 | v209.55,107.95 U113.2 | v440.69,213.36 440.69,152.4 U156.13 439.42,138.43 440.69,137.16 v440.69,107.95
  Bottom 0.254: v440.69,213.36 v464.82,213.36 | v82.55,107.95 v209.55,107.95 v336.55,107.95 v440.69,107.95 v463.55,107.95
A2  (via drill 0.51 pad 0.99)  (7 unrouted)
  Top 0.254: 462.28,199.39 462.28,202.06 461.01,203.33 461.01,207.9 462.28,209.17 v462.28,212.09 | v435.61,212.09 435.61,209.17 434.34,207.9 434.34,206.63 436.88,204.09 U156.14 436.88,138.43 438.15,137.16 v438.15,97.79
  Bottom 0.254: v435.61,212.09 v462.28,212.09 | U96.3 81.28,97.79 207.01,97.79 | 334.01,97.79 207.01,97.79 | 334.01,97.79 v438.15,97.79 459.74,97.79 U147.3 | 334.01,97.79 U130.3 | 207.01,97.79 U113.3
A3
  Top 0.254: U156.15 435.61,152.4 435.61,179.07 | 435.61,179.07 U157.1 | 435.61,179.07 435.61,196.85 U158.1
A4
  Top 0.254: U158.2 431.8,197.87 433.07,196.6 433.07,179.07 | 433.07,179.07 U157.2 | 433.07,179.07 433.07,152.4 U156.16
A5
  Top 0.254: U156.17 430.53,152.4 430.53,179.07 | 430.53,179.07 U157.3 | 430.53,179.07 430.53,196.85 U158.3
D0  (via drill 0.51, 0.51 pad 0.99)  (28 unrouted)
  Top 0.254: v435.61,207.01 435.61,208.28 | 467.36,208.28 v467.36,207.01 467.36,153.67 466.09,152.4 466.09,137.16 U156.39 v467.36,105.41 467.36,78.74 U146.2 | v510.79,207.01 510.41,207.39 510.41,222.12 | v479.04,207.01 478.66,207.39 | v447.29,207.01 446.91,207.39 | v415.54,207.01 415.16,207.39 | 383.41,158.88 U71.2 | U73.2 351.66,158.88 | 319.91,158.88 U75.2 | 288.16,158.88 U77.2 | 256.41,158.88 U54.2 | 224.66,158.88 U56.2 | 192.91,158.88 U58.2 | 161.16,158.88 U60.2 | v383.79,105.41 384.18,105.03 384.18,100.71 383.41,99.95 383.41,84.07 383.79,83.69 383.79,81.28 383.41,80.9 383.41,57.28 U122.2 | v24.13,105.41 U95.2 | v373.38,105.41 U123.2 | v352.04,105.41 352.43,105.03 352.43,100.71 351.66,99.95 351.66,84.07 352.04,83.69 352.04,81.28 351.66,80.9 351.66,57.28 U124.2 | v34.54,105.41 34.92,105.03 34.92,100.71 34.16,99.95 34.16,84.07 34.54,83.69 34.54,81.28 34.16,80.9 34.16,57.28 U94.2 | v340.36,105.41 340.36,78.74 U125.2 | v320.29,105.41 320.68,105.03 320.68,100.71 319.91,99.95 319.91,84.07 320.29,83.69 320.29,81.28 319.91,80.9 319.91,57.28 U126.2 | v66.29,105.41 66.67,105.03 66.67,100.71 65.91,99.95 65.91,84.07 66.29,83.69 66.29,81.28 65.91,80.9 65.91,57.28 U92.2 | v86.36,105.41 86.36,78.74 U91.2 | v309.88,105.41 U127.2 | v288.54,105.41 288.93,105.03 288.93,100.71 288.16,99.95 288.16,84.07 288.54,83.69 288.54,81.28 288.16,80.9 288.16,57.28 U128.2 | v98.04,105.41 98.42,105.03 98.42,100.71 97.66,99.95 97.66,84.07 98.04,83.69 98.04,81.28 97.66,80.9 97.66,57.28 U90.2 | v119.38,105.41 U89.2 | v278.13,105.41 U129.2 | v256.79,105.41 257.18,105.03 257.18,100.71 256.41,99.95 256.41,84.07 256.79,83.69 256.79,81.28 256.41,80.9 256.41,57.28 U105.2
  Top 0.254: v129.79,105.41 130.18,105.03 130.18,100.71 129.41,99.95 129.41,84.07 129.79,83.69 129.79,81.28 129.41,80.9 129.41,57.28 U88.2 | v151.13,105.41 U112.2 | v246.38,105.41 U106.2 | v225.04,105.41 225.43,105.03 225.43,100.71 224.66,99.95 224.66,84.07 225.04,83.69 225.04,81.28 224.66,80.9 224.66,57.28 U107.2 | v161.54,105.41 161.93,105.03 161.93,100.71 161.16,99.95 161.16,84.07 161.54,83.69 161.54,81.28 161.16,80.9 161.16,57.28 U111.2 | v213.36,105.41 213.36,78.74 U108.2 | v193.29,105.41 193.68,105.03 193.68,100.71 192.91,99.95 192.91,84.07 193.29,83.69 193.29,81.28 192.91,80.9 192.91,57.28 U109.2 | v55.88,105.41 U93.2 | v182.88,105.41 U110.2 | v405.13,105.41 U142.2 | v436.88,105.41 U140.2 | v500.38,105.41 U144.2 | v510.79,105.41 511.18,105.03 511.18,100.71 510.41,99.95 510.41,84.07 510.79,83.69 510.79,81.28 510.41,80.9 510.41,57.28 U143.2 | v479.04,105.41 479.43,105.03 479.43,100.71 478.66,99.95 478.66,84.07 479.04,83.69 479.04,81.28 478.66,80.9 478.66,57.28 U145.2 | v447.29,105.41 447.68,105.03 447.68,100.71 446.91,99.95 446.91,84.07 447.29,83.69 447.29,81.28 446.91,80.9 446.91,57.28 U139.2 | v415.54,105.41 415.93,105.03 415.93,100.71 415.16,99.95 415.16,84.07 415.54,83.69 415.54,81.28 415.16,80.9 415.16,57.28 U141.2
  Top 0.305: IC8.19 51.58,172.13 v51.75,171.96 | IC7.19 51.58,182.29 v51.75,182.12 | IC6.19 51.58,192.45 v51.75,192.28 | IC5.19 51.58,202.61 v51.75,202.44 | IC4.19 51.58,212.77 v51.75,212.6 | IC3.19 51.58,222.93 v51.75,222.76 | IC2.19 51.58,233.09 v51.75,232.92 | IC1.19 51.58,243.25 | 51.58,243.25 v51.75,243.08 | IC11.19 78.75,172.13 v78.93,171.96 | IC10.19 78.75,182.29 v78.93,182.12 | IC17.19 78.75,192.45 v78.93,192.28 | IC16.19 78.75,202.61 v78.93,202.44 | IC15.19 78.75,212.77 v78.93,212.6 | IC14.19 78.75,222.93 v78.93,222.76 | IC13.19 78.75,233.09 v78.93,232.92 | IC12.19 78.75,243.25 | 78.75,243.25 v78.93,243.08 | IC19.19 106.44,172.13 v106.62,171.96 | IC18.19 106.44,182.29 v106.62,182.12 | IC25.19 106.44,192.45 v106.62,192.28 | IC24.19 106.44,202.61 v106.62,202.44 | IC23.19 106.44,212.77 v106.62,212.6 | IC22.19 106.44,222.93 v106.62,222.76 | IC21.19 106.44,233.09 v106.62,232.92 | IC20.19 106.44,243.25 v106.62,243.08 | IC27.19 316.34,244.14 v316.17,243.97 | IC26.19 326.5,244.14 v326.33,243.97 | IC33.19 336.66,244.14 v336.49,243.97 | IC32.19 346.82,244.14 v346.65,243.97 | IC31.19 368.35,244.14 v368.17,243.97 | IC30.19 378.51,244.14 v378.33,243.97 | IC29.19 388.67,244.14 v388.49,243.97 | IC28.19 398.83,244.14 v398.65,243.97 | 51.58,243.25 51.61,243.25 | 78.75,243.25 78.75,243.28
  Bottom 0.254: v405.13,207.01 v415.54,207.01 v435.61,207.01 v447.29,207.01 v467.36,207.01 v479.04,207.01 v500.38,207.01 v510.79,207.01 | v510.79,105.41 v500.38,105.41 v479.04,105.41 v467.36,105.41 v447.29,105.41 v436.88,105.41 v415.54,105.41 v405.13,105.41 v383.79,105.41 v373.38,105.41 v352.04,105.41 v340.36,105.41 v320.29,105.41 v309.88,105.41 v288.54,105.41 v278.13,105.41 v256.79,105.41 v246.38,105.41 v225.04,105.41 v213.36,105.41 v193.29,105.41 v182.88,105.41 v161.54,105.41 v151.13,105.41 v129.79,105.41 v119.38,105.41 v98.04,105.41 v86.36,105.41 v66.29,105.41 v55.88,105.41 v34.54,105.41 v24.13,105.41
  Bottom 0.305: v51.75,171.96 v51.75,182.12 v51.75,192.28 v51.75,202.44 v51.75,212.6 v51.75,222.76 v51.75,232.92 v51.75,243.08 | v78.93,171.96 v78.93,182.12 v78.93,192.28 v78.93,202.44 v78.93,212.6 v78.93,222.76 v78.93,232.92 v78.93,243.08 | v106.62,171.96 v106.62,182.12 v106.62,192.28 v106.62,202.44 v106.62,212.6 v106.62,222.76 v106.62,232.92 v106.62,243.08 | v316.17,243.97 v326.33,243.97 v336.49,243.97 v346.65,243.97 v368.17,243.97 v378.33,243.97 v388.49,243.97 v398.65,243.97
D1  (via drill 0.51, 0.51 pad 0.99)  (28 unrouted)
  Top 0.254: 160.66,156.84 U60.3 | v433.07,205.74 433.07,208.28 | 464.82,208.28 v464.82,205.74 464.82,153.67 463.55,152.4 463.55,137.16 U156.38 v464.82,104.14 464.82,78.74 U146.3 | v510.29,205.74 509.9,206.12 509.9,224.16 | v478.54,205.74 478.15,206.12 | v446.79,205.74 446.4,206.12 | v415.04,205.74 414.65,206.12 | 382.9,156.84 U71.3 | 351.15,156.84 U73.3 | 319.4,156.84 U75.3 | 287.65,156.84 U77.3 | 255.91,156.84 U54.3 | 224.16,156.84 U56.3 | 192.41,156.84 U58.3 | v383.29,104.14 383.67,103.76 383.67,100.97 382.9,100.2 382.9,83.82 383.29,83.44 383.29,81.53 382.9,81.15 382.9,55.24 U122.3 | v370.84,104.14 U123.3 | v351.54,104.14 351.92,103.76 351.92,100.97 351.15,100.2 351.15,83.82 351.54,83.44 351.54,81.53 351.15,81.15 351.15,55.24 U124.3 | v337.82,104.14 337.82,78.74 U125.3 | v319.79,104.14 320.17,103.76 320.17,100.97 319.4,100.2 319.4,83.82 319.79,83.44 319.79,81.53 319.4,81.15 319.4,55.24 U126.3 | v307.34,104.14 U127.3 | v288.04,104.14 288.42,103.76 288.42,100.97 287.65,100.2 287.65,83.82 288.04,83.44 288.04,81.53 287.65,81.15 287.65,55.24 U128.3 | v275.59,104.14 U129.3 | v256.29,104.14 256.67,103.76 256.67,100.97 255.91,100.2 255.91,83.82 256.29,83.44 256.29,81.53 255.91,81.15 255.91,55.24 U105.3 | v21.59,104.14 U95.3 | v243.84,104.14 U106.3 | v224.54,104.14 224.92,103.76 224.92,100.97 224.16,100.2 224.16,83.82 224.54,83.44 224.54,81.53 224.16,81.15 224.16,55.24 U107.3 | v34.04,104.14 34.42,103.76 34.42,100.97 33.66,100.2 33.66,83.82 34.04,83.44 34.04,81.53 33.66,81.15 33.66,55.24 U94.3 | v210.82,104.14 210.82,78.74 U108.3 | v192.79,104.14 193.17,103.76 193.17,100.97 192.41,100.2 192.41,83.82 192.79,83.44 192.79,81.53 192.41,81.15 192.41,55.24 U109.3
  Top 0.254: v65.79,104.14 66.17,103.76 66.17,100.97 65.41,100.2 65.41,83.82 65.79,83.44 65.79,81.53 65.41,81.15 65.41,55.24 U92.3 | v83.82,104.14 83.82,78.74 U91.3 | v161.04,104.14 161.42,103.76 161.42,100.97 160.66,100.2 160.66,83.82 161.04,83.44 161.04,81.53 160.66,81.15 160.66,55.24 U111.3 | v97.54,104.14 97.92,103.76 97.92,100.97 97.16,100.2 97.16,83.82 97.54,83.44 97.54,81.53 97.16,81.15 97.16,55.24 U90.3 | v116.84,104.14 U89.3 | v148.59,104.14 U112.3 | v129.29,104.14 129.67,103.76 129.67,100.97 128.91,100.2 128.91,83.82 129.29,83.44 129.29,81.53 128.91,81.15 128.91,55.24 U88.3 | v53.34,104.14 U93.3 | v180.34,104.14 U110.3 | v402.59,104.14 U142.3 | U140.3 v434.34,104.14 | v497.84,104.14 U144.3 | v510.29,104.14 510.67,103.76 510.67,100.97 509.9,100.2 509.9,83.82 510.29,83.44 510.29,81.53 509.9,81.15 509.9,55.24 U143.3 | v478.54,104.14 478.92,103.76 478.92,100.97 478.15,100.2 478.15,83.82 478.54,83.44 478.54,81.53 478.15,81.15 478.15,55.24 U145.3 | v446.79,104.14 447.17,103.76 447.17,100.97 446.4,100.2 446.4,83.82 446.79,83.44 446.79,81.53 446.4,81.15 446.4,55.24 U139.3 | v415.04,104.14 415.42,103.76 415.42,100.97 414.65,100.2 414.65,83.82 415.04,83.44 415.04,81.53 414.65,81.15 414.65,55.24 U141.3
  Top 0.305: IC8.18 50.64,171.48 v50.86,171.26 | IC7.18 50.58,181.64 v50.86,181.36 | IC6.18 50.58,191.8 v50.86,191.52 | IC5.18 50.58,201.96 v50.86,201.68 | IC4.18 50.58,212.12 v50.86,211.84 | IC3.18 50.58,222.28 v50.86,222 | IC2.18 50.58,232.44 v50.86,232.16 | IC1.18 50.64,242.6 v50.86,242.32 | IC11.18 77.82,171.48 v78.04,171.26 | IC10.18 77.75,181.64 v78.04,181.36 | IC17.18 77.75,191.8 v78.04,191.52 | IC16.18 77.75,201.96 v78.04,201.68 | IC15.18 77.75,212.12 v78.04,211.84 | IC14.18 77.75,222.28 v78.04,222 | IC13.18 77.75,232.44 v78.04,232.16 | IC12.18 77.82,242.6 v78.04,242.32 | IC19.18 105.5,171.48 v105.73,171.26 | IC18.18 105.44,181.64 v105.73,181.36 | IC25.18 105.44,191.8 v105.73,191.52 | IC24.18 105.44,201.96 v105.73,201.68 | IC23.18 105.44,212.12 v105.73,211.84 | IC22.18 105.44,222.28 v105.73,222 | IC21.18 105.44,232.44 v105.73,232.16 | IC20.18 105.5,242.6 v105.73,242.32 | IC27.18 315.69,245.08 v315.47,244.86 | IC26.18 325.85,245.14 v325.56,244.86 | IC33.18 336.01,245.14 v335.72,244.86 | IC32.18 346.17,245.14 v345.88,244.86 | IC31.18 367.7,245.14 v367.41,244.86 | IC30.18 377.86,245.14 v377.57,244.86 | IC29.18 388.02,245.14 v387.73,244.86 | IC28.18 398.18,245.08 v397.89,244.86
  Bottom 0.254: v402.59,205.74 v415.04,205.74 v433.07,205.74 v446.79,205.74 v464.82,205.74 v478.54,205.74 v497.84,205.74 v510.29,205.74 | v510.29,104.14 v497.84,104.14 v478.54,104.14 v464.82,104.14 v446.79,104.14 v434.34,104.14 v415.04,104.14 v402.59,104.14 v383.29,104.14 v370.84,104.14 v351.54,104.14 v337.82,104.14 v319.79,104.14 v307.34,104.14 v288.04,104.14 v275.59,104.14 v256.29,104.14 v243.84,104.14 v224.54,104.14 v210.82,104.14 v192.79,104.14 v180.34,104.14 v161.04,104.14 v148.59,104.14 v129.29,104.14 v116.84,104.14 v97.54,104.14 v83.82,104.14 v65.79,104.14 v53.34,104.14 v34.04,104.14 v21.59,104.14
  Bottom 0.305: v50.86,171.26 v50.86,181.36 v50.86,191.52 v50.86,201.68 v50.86,211.84 v50.86,222 v50.86,232.16 v50.86,242.32 | v78.04,171.26 v78.04,181.36 v78.04,191.52 v78.04,201.68 v78.04,211.84 v78.04,222 v78.04,232.16 v78.04,242.32 | v105.73,171.26 v105.73,181.36 v105.73,191.52 v105.73,201.68 v105.73,211.84 v105.73,222 v105.73,232.16 v105.73,242.32 | v315.47,244.86 v325.56,244.86 v335.72,244.86 v345.88,244.86 v367.41,244.86 v377.57,244.86 v387.73,244.86 v397.89,244.86
D2  (via drill 0.51, 0.51 pad 0.99)  (28 unrouted)
  Top 0.254: v430.53,204.47 430.53,208.28 | 462.28,208.28 v462.28,204.47 462.79,203.96 462.79,199.01 462.28,198.5 462.28,153.67 461.01,152.4 461.01,137.16 U156.37 v462.28,102.87 462.28,78.74 U146.4 | v509.78,204.47 509.4,204.85 509.4,226.19 | v478.03,204.47 477.65,204.85 | v446.28,204.47 445.9,204.85 | v414.53,204.47 414.15,204.85 | 382.4,154.81 U71.4 | 350.65,154.81 U73.4 | 318.9,154.81 U75.4 | 287.15,154.81 U77.4 | 255.4,154.81 U54.4 | 223.65,154.81 U56.4 | 191.9,154.81 U58.4 | 160.15,154.81 U60.4 | v19.05,102.87 U95.4 | v33.53,102.87 33.91,102.49 33.91,101.22 33.15,100.46 33.15,83.57 33.53,83.19 33.53,81.79 33.15,81.41 33.15,53.21 U94.4 | v65.28,102.87 65.66,102.49 65.66,101.22 64.9,100.46 64.9,83.57 65.28,83.19 65.28,81.79 64.9,81.41 64.9,53.21 U92.4 | v81.28,102.87 81.28,78.74 U91.4 | v97.03,102.87 97.41,102.49 97.41,101.22 96.65,100.46 96.65,83.57 97.03,83.19 97.03,81.79 96.65,81.41 96.65,53.21 U90.4 | v114.3,102.87 U89.4 | v128.78,102.87 129.16,102.49 129.16,101.22 128.4,100.46 128.4,83.57 128.78,83.19 128.78,81.79 128.4,81.41 128.4,53.21 U88.4 | v146.05,102.87 U112.4 | v160.53,102.87 160.91,102.49 160.91,101.22 160.15,100.46 160.15,83.57 160.53,83.19 160.53,81.79 160.15,81.41 160.15,53.21 U111.4 | v192.28,102.87 192.66,102.49 192.66,101.22 191.9,100.46 191.9,83.57 192.28,83.19 192.28,81.79 191.9,81.41 191.9,53.21 U109.4 | v208.28,102.87 208.28,78.74 U108.4 | v224.03,102.87 224.41,102.49 224.41,101.22 223.65,100.46 223.65,83.57 224.03,83.19 224.03,81.79 223.65,81.41 223.65,53.21 U107.4 | v241.3,102.87 U106.4 | v255.78,102.87 256.16,102.49 256.16,101.22 255.4,100.46 255.4,83.57 255.78,83.19 255.78,81.79 255.4,81.41 255.4,53.21 U105.4
  Top 0.254: v273.05,102.87 U129.4 | v287.53,102.87 287.91,102.49 287.91,101.22 287.15,100.46 287.15,83.57 287.53,83.19 287.53,81.79 287.15,81.41 287.15,53.21 U128.4 | v304.8,102.87 U127.4 | v319.28,102.87 319.66,102.49 319.66,101.22 318.9,100.46 318.9,83.57 319.28,83.19 319.28,81.79 318.9,81.41 318.9,53.21 U126.4 | v335.28,102.87 335.28,78.74 U125.4 | v351.03,102.87 351.41,102.49 351.41,101.22 350.65,100.46 350.65,83.57 351.03,83.19 351.03,81.79 350.65,81.41 350.65,53.21 U124.4 | v368.3,102.87 U123.4 | v382.78,102.87 383.16,102.49 383.16,101.22 382.4,100.46 382.4,83.57 382.78,83.19 382.78,81.79 382.4,81.41 382.4,53.21 U122.4 | v50.8,102.87 U93.4 | v177.8,102.87 U110.4 | v400.05,102.87 U142.4 | U140.4 v431.8,102.87 | v495.3,102.87 U144.4 | v509.78,102.87 510.16,102.49 510.16,101.22 509.4,100.46 509.4,83.57 509.78,83.19 509.78,81.79 509.4,81.41 509.4,53.21 U143.4 | v478.03,102.87 478.41,102.49 478.41,101.22 477.65,100.46 477.65,83.57 478.03,83.19 478.03,81.79 477.65,81.41 477.65,53.21 U145.4 | v446.28,102.87 446.66,102.49 446.66,101.22 445.9,100.46 445.9,83.57 446.28,83.19 446.28,81.79 445.9,81.41 445.9,53.21 U139.4 | v414.53,102.87 414.91,102.49 414.91,101.22 414.15,100.46 414.15,83.57 414.53,83.19 414.53,81.79 414.15,81.41 414.15,53.21 U141.4
  Top 0.305: IC8.17 49.7,170.83 v49.97,170.56 | IC7.17 49.64,180.99 v49.97,180.66 | IC6.17 49.64,191.15 v49.97,190.82 | IC5.17 49.64,201.31 v49.97,200.98 | IC4.17 49.64,211.47 v49.97,211.14 | IC3.17 49.64,221.63 v49.97,221.3 | IC2.17 49.64,231.79 v49.97,231.46 | IC1.17 49.64,241.95 v49.97,241.62 | IC11.17 76.88,170.83 v77.15,170.56 | IC10.17 76.82,180.99 v77.15,180.66 | IC17.17 76.82,191.15 v77.15,190.82 | IC16.17 76.82,201.31 v77.15,200.98 | IC15.17 76.82,211.47 v77.15,211.14 | IC14.17 76.82,221.63 v77.15,221.3 | IC13.17 76.82,231.79 v77.15,231.46 | IC12.17 76.82,241.95 v77.15,241.62 | IC19.17 104.57,170.83 v104.84,170.56 | IC18.17 104.5,180.99 v104.84,180.66 | IC25.17 104.5,191.15 v104.84,190.82 | IC24.17 104.5,201.31 v104.84,200.98 | IC23.17 104.5,211.47 v104.84,211.14 | IC22.17 104.5,221.63 v104.84,221.3 | IC21.17 104.5,231.79 v104.84,231.46 | IC20.17 104.5,241.95 v104.84,241.62 | IC27.17 315.04,246.02 v314.77,245.75 | IC26.17 325.2,246.08 v324.87,245.75 | IC33.17 335.36,246.08 v335.03,245.75 | IC32.17 345.52,246.08 v345.19,245.75 | IC31.17 367.05,246.08 v366.71,245.75 | IC30.17 377.21,246.08 v376.87,245.75 | IC29.17 387.37,246.08 v387.03,245.75 | IC28.17 397.53,246.08 v397.19,245.75
  Bottom 0.254: v400.05,204.47 v414.53,204.47 v430.53,204.47 v446.28,204.47 v462.28,204.47 v478.03,204.47 v495.3,204.47 v509.78,204.47 | v19.05,102.87 v33.53,102.87 v50.8,102.87 v65.28,102.87 v81.28,102.87 v97.03,102.87 v114.3,102.87 v128.78,102.87 v146.05,102.87 v160.53,102.87 v177.8,102.87 v192.28,102.87 v208.28,102.87 v224.03,102.87 v241.3,102.87 v255.78,102.87 v273.05,102.87 v287.53,102.87 v304.8,102.87 v319.28,102.87 v335.28,102.87 v351.03,102.87 v368.3,102.87 v382.78,102.87 v400.05,102.87 v414.53,102.87 v431.8,102.87 v446.28,102.87 v462.28,102.87 v478.03,102.87 v495.3,102.87 v509.78,102.87
  Bottom 0.305: v49.97,170.56 v49.97,180.66 v49.97,190.82 v49.97,200.98 v49.97,211.14 v49.97,221.3 v49.97,231.46 v49.97,241.62 | v77.15,170.56 v77.15,180.66 v77.15,190.82 v77.15,200.98 v77.15,211.14 v77.15,221.3 v77.15,231.46 v77.15,241.62 | v104.84,170.56 v104.84,180.66 v104.84,190.82 v104.84,200.98 v104.84,211.14 v104.84,221.3 v104.84,231.46 v104.84,241.62 | v314.77,245.75 v324.87,245.75 v335.03,245.75 v345.19,245.75 v366.71,245.75 v376.87,245.75 v387.03,245.75 v397.19,245.75
D3  (via drill 0.51, 0.51 pad 0.99)  (28 unrouted)
  Top 0.254: v427.99,203.2 427.99,208.28 | 459.74,208.28 v459.74,203.2 459.74,153.67 458.47,152.4 458.47,137.16 U156.36 v459.74,101.6 459.74,78.74 U146.5 | v509.27,203.2 508.89,203.58 508.89,226.44 | v477.52,203.2 477.14,203.58 | v445.77,203.2 445.39,203.58 | v414.02,203.2 413.64,203.58 | 381.89,154.56 U71.5 | 350.14,154.56 U73.5 | 318.39,154.56 U75.5 | 286.64,154.56 U77.5 | 254.89,154.56 U54.5 | 223.14,154.56 U56.5 | 191.39,154.56 U58.5 | 159.64,154.56 U60.5 | v382.27,101.6 381.89,101.22 381.89,83.31 382.27,82.93 382.27,82.04 381.89,81.66 381.89,52.96 U122.5 | v365.76,101.6 U123.5 | v350.52,101.6 350.14,101.22 350.14,83.31 350.52,82.93 350.52,82.04 350.14,81.66 350.14,52.96 U124.5 | v332.74,101.6 332.74,78.74 U125.5 | v318.77,101.6 318.39,101.22 318.39,83.31 318.77,82.93 318.77,82.04 318.39,81.66 318.39,52.96 U126.5 | v302.26,101.6 U127.5 | v287.02,101.6 286.64,101.22 286.64,83.31 287.02,82.93 287.02,82.04 286.64,81.66 286.64,52.96 U128.5 | v270.51,101.6 U129.5 | v255.27,101.6 254.89,101.22 254.89,83.31 255.27,82.93 255.27,82.04 254.89,81.66 254.89,52.96 U105.5 | v16.51,101.6 U95.5 | v238.76,101.6 U106.5 | v223.52,101.6 223.14,101.22 223.14,83.31 223.52,82.93 223.52,82.04 223.14,81.66 223.14,52.96 U107.5 | v33.02,101.6 32.64,101.22 32.64,83.31 33.02,82.93 33.02,82.04 32.64,81.66 32.64,52.96 U94.5 | v205.74,101.6 205.74,78.74 U108.5 | v191.77,101.6 191.39,101.22 191.39,83.31 191.77,82.93 191.77,82.04 191.39,81.66 191.39,52.96 U109.5 | v64.77,101.6 64.39,101.22 64.39,83.31 64.77,82.93 64.77,82.04 64.39,81.66 64.39,52.96 U92.5 | v78.74,101.6 78.74,78.74 U91.5 | v160.02,101.6 159.64,101.22 159.64,83.31 160.02,82.93 160.02,82.04 159.64,81.66 159.64,52.96 U111.5
  Top 0.254: v96.52,101.6 96.14,101.22 96.14,83.31 96.52,82.93 96.52,82.04 96.14,81.66 96.14,52.96 U90.5 | v111.76,101.6 U89.5 | v143.51,101.6 U112.5 | v128.27,101.6 127.89,101.22 127.89,83.31 128.27,82.93 128.27,82.04 127.89,81.66 127.89,52.96 U88.5 | v48.26,101.6 U93.5 | v175.26,101.6 U110.5 | v397.51,101.6 U142.5 | v429.26,101.6 U140.5 | v492.76,101.6 U144.5 | v509.27,101.6 508.89,101.22 508.89,83.31 509.27,82.93 509.27,82.04 508.89,81.66 508.89,52.96 U143.5 | v477.52,101.6 477.14,101.22 477.14,83.31 477.52,82.93 477.52,82.04 477.14,81.66 477.14,52.96 U145.5 | v445.77,101.6 445.39,101.22 445.39,83.31 445.77,82.93 445.77,82.04 445.39,81.66 445.39,52.96 U139.5 | v414.02,101.6 413.64,101.22 413.64,83.31 414.02,82.93 414.02,82.04 413.64,81.66 413.64,52.96 U141.5
  Top 0.305: IC8.16 48.76,170.18 v49.09,169.86 | IC7.16 48.7,180.34 v49.09,179.96 | IC6.16 48.7,190.5 v49.09,190.12 | IC5.16 48.7,200.66 v49.09,200.28 | IC4.16 48.7,210.82 v49.09,210.44 | IC3.16 48.7,220.98 v49.09,220.6 | IC2.16 48.7,231.14 v49.09,230.76 | IC1.16 48.7,241.3 v49.09,240.92 | IC11.16 75.94,170.18 v76.26,169.86 | IC10.16 75.88,180.34 v76.26,179.96 | IC17.16 75.88,190.5 v76.26,190.12 | IC16.16 75.88,200.66 v76.26,200.28 | IC15.16 75.88,210.82 v76.26,210.44 | IC14.16 75.88,220.98 v76.26,220.6 | IC13.16 75.88,231.14 v76.26,230.76 | IC12.16 75.88,241.3 v76.26,240.92 | IC19.16 103.63,170.18 v103.95,169.86 | IC18.16 103.56,180.34 v103.95,179.96 | IC25.16 103.56,190.5 v103.95,190.12 | IC24.16 103.56,200.66 v103.95,200.28 | IC23.16 103.56,210.82 v103.95,210.44 | IC22.16 103.56,220.98 v103.95,220.6 | IC21.16 103.56,231.14 v103.95,230.76 | IC20.16 103.56,241.3 v103.95,240.92 | IC27.16 314.39,246.96 v314.07,246.63 | IC26.16 324.55,247.02 v324.17,246.63 | IC33.16 334.71,247.02 v334.33,246.63 | IC32.16 344.87,247.02 v344.49,246.63 | IC31.16 366.4,247.02 v366.01,246.63 | IC30.16 376.56,247.02 v376.17,246.63 | IC29.16 386.72,247.02 v386.33,246.63 | IC28.16 396.88,247.02 v396.49,246.63
  Bottom 0.254: v414.02,203.2 v427.99,203.2 v445.77,203.2 v459.74,203.2 v477.52,203.2 v492.76,203.2 v509.27,203.2 | v509.27,101.6 v492.76,101.6 v477.52,101.6 v459.74,101.6 v445.77,101.6 v429.26,101.6 v414.02,101.6 v397.51,101.6 v382.27,101.6 v365.76,101.6 v350.52,101.6 v332.74,101.6 v318.77,101.6 v302.26,101.6 v287.02,101.6 v270.51,101.6 v255.27,101.6 v238.76,101.6 v223.52,101.6 v205.74,101.6 v191.77,101.6 v175.26,101.6 v160.02,101.6 v143.51,101.6 v128.27,101.6 v111.76,101.6 v96.52,101.6 v78.74,101.6 v64.77,101.6 v48.26,101.6 v33.02,101.6 v16.51,101.6
  Bottom 0.305: v49.09,169.86 v49.09,179.96 v49.09,190.12 v49.09,200.28 v49.09,210.44 v49.09,220.6 v49.09,230.76 v49.09,240.92 | v76.26,169.86 v76.26,179.96 v76.26,190.12 v76.26,200.28 v76.26,210.44 v76.26,220.6 v76.26,230.76 v76.26,240.92 | v103.95,169.86 v103.95,179.96 v103.95,190.12 v103.95,200.28 v103.95,210.44 v103.95,220.6 v103.95,230.76 v103.95,240.92 | v314.07,246.63 v324.17,246.63 v334.33,246.63 v344.49,246.63 v366.01,246.63 v376.17,246.63 v386.33,246.63 v396.49,246.63
D4  (via drill 0.51, 0.51 pad 0.99)  (28 unrouted)
  Top 0.254: v425.45,184.15 425.45,208.28 | 457.2,208.28 v457.2,184.15 455.93,182.88 455.93,137.16 U156.35 v457.2,82.55 457.2,78.74 U146.6 | v508.38,184.15 508.38,224.41 | 381.38,156.59 U71.6 | 349.63,156.59 U73.6 | 317.88,156.59 U75.6 | 286.13,156.59 U77.6 | 254.38,156.59 U54.6 | 222.63,156.59 U56.6 | 190.88,156.59 U58.6 | 159.13,156.59 U60.6 | v13.97,82.55 U95.6 | v76.2,82.55 76.2,78.74 U91.6 | v109.22,82.55 U89.6 | v140.97,82.55 U112.6 | v203.2,82.55 203.2,78.74 U108.6 | v236.22,82.55 U106.6 | v267.97,82.55 U129.6 | v299.72,82.55 U127.6 | v330.2,82.55 330.2,78.74 U125.6 | v363.22,82.55 U123.6 | v32.13,82.55 32.13,54.99 U94.6 | v63.88,82.55 63.88,54.99 U92.6 | v95.63,82.55 95.63,54.99 U90.6 | v381.38,82.55 381.38,54.99 U122.6 | v349.63,82.55 349.63,54.99 U124.6 | v317.88,82.55 317.88,54.99 U126.6 | v286.13,82.55 286.13,54.99 U128.6 | v254.38,82.55 254.38,54.99 U105.6 | v222.63,82.55 222.63,54.99 U107.6 | v190.88,82.55 190.88,54.99 U109.6 | v159.13,82.55 159.13,54.99 U111.6 | v127.38,82.55 127.38,54.99 U88.6 | v45.72,82.55 U93.6 | v172.72,82.55 U110.6 | v394.97,82.55 U142.6 | v426.72,82.55 U140.6 | v490.22,82.55 U144.6 | v508.38,82.55 508.38,54.99 U143.6 | v476.63,82.55 476.63,54.99 U145.6 | v444.88,82.55 444.88,54.99 U139.6 | v413.13,82.55 413.13,54.99 U141.6
  Top 0.305: IC8.15 47.83,169.53 v48.2,169.16 | IC7.15 47.76,179.69 v48.2,179.26 | IC6.15 47.76,189.85 v48.2,189.42 | IC5.15 47.76,200.01 v48.2,199.58 | IC4.15 47.76,210.17 v48.2,209.74 | IC3.15 47.76,220.33 v48.2,219.9 | IC2.15 47.76,230.49 v48.2,230.06 | IC1.15 47.76,240.65 v48.2,240.22 | IC11.15 75,169.53 v75.37,169.16 | IC10.15 74.94,179.69 v75.37,179.26 | IC17.15 74.94,189.85 v75.37,189.42 | IC16.15 74.94,200.01 v75.37,199.58 | IC15.15 74.94,210.17 v75.37,209.74 | IC14.15 74.94,220.33 v75.37,219.9 | IC13.15 74.94,230.49 v75.37,230.06 | IC12.15 74.94,240.65 v75.37,240.22 | IC19.15 102.69,169.53 v103.06,169.16 | IC18.15 102.63,179.69 v103.06,179.26 | IC25.15 102.63,189.85 v103.06,189.42 | IC24.15 102.63,200.01 v103.06,199.58 | IC23.15 102.63,210.17 v103.06,209.74 | IC22.15 102.63,220.33 v103.06,219.9 | IC21.15 102.63,230.49 v103.06,230.06 | IC20.15 102.63,240.65 v103.06,240.22 | IC27.15 313.74,247.89 v313.37,247.52 | IC26.15 323.9,247.96 v323.47,247.52 | IC33.15 334.06,247.96 v333.63,247.52 | IC32.15 344.22,247.96 v343.79,247.52 | IC31.15 365.75,247.96 v365.31,247.52 | IC30.15 375.91,247.96 v375.48,247.52 | IC29.15 386.07,247.96 v385.63,247.52 | IC28.15 396.23,247.96 v395.8,247.52